# Altium schematic sheet 02-BlockDiagram.SchDoc: Block Diagram
size A3; DocumentNumber: 2; SheetNumber: 2; SheetTotal: 5
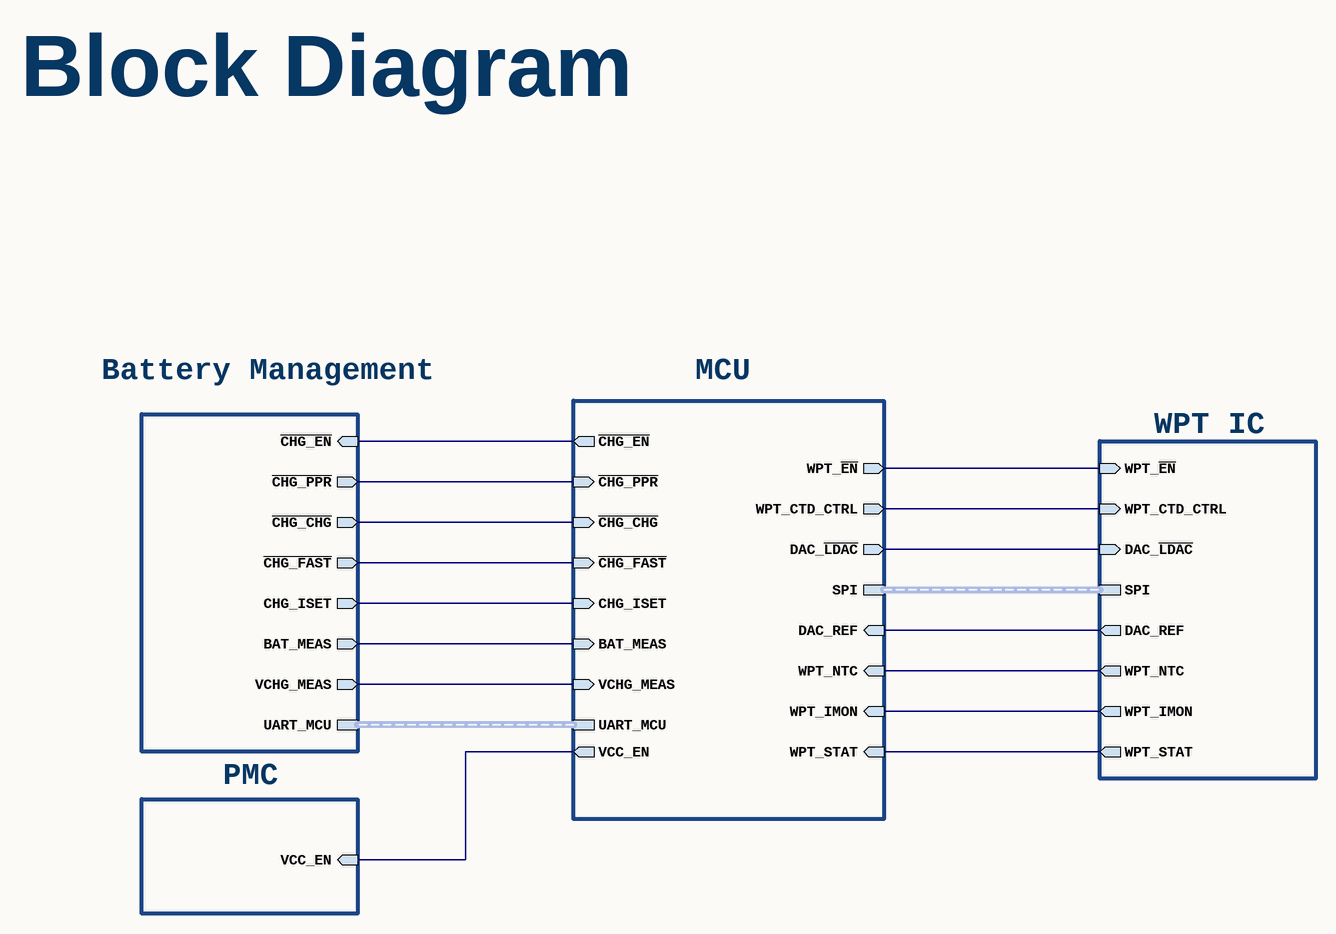
[diagram p0: 02-BlockDiagram.SchDoc]

## Sub-sheets
Battery Management = 06-BatteryManagement.SchDoc: ~{CHG_EN} (in), ~{CHG_PPR} (out), ~{CHG_CHG} (out), ~{CHG_FAST} (out), CHG_ISET (out), UART_MCU (harness UART_MCU), BAT_MEAS (out), VCHG_MEAS (out)
MCU = 03-MCU.SchDoc: ~{CHG_EN} (out), ~{CHG_PPR} (in), ~{CHG_CHG} (in), ~{CHG_FAST} (in), CHG_ISET (in), UART_MCU (harness UART_MCU), WPT_NTC (in), DAC_REF (in), DAC_~{LDAC} (out), WPT_CTD_CTRL (out), WPT_~{EN} (out), SPI (harness SPI), VCC_EN (out), WPT_IMON (in), WPT_STAT (in), BAT_MEAS (in), VCHG_MEAS (in)
PMC = 05-PMC.SchDoc: VCC_EN (in)
WPT IC = 04-WPT-IC.SchDoc: WPT_NTC (out), DAC_REF (out), DAC_~{LDAC} (in), WPT_CTD_CTRL (in), WPT_~{EN} (in), SPI (harness SPI), WPT_IMON (out), WPT_STAT (out)

## Nets
(unnamed): sheet MCU/~{CHG_EN}, sheet Battery Management/~{CHG_EN}
(unnamed): sheet MCU/~{CHG_PPR}, sheet Battery Management/~{CHG_PPR}
(unnamed): sheet MCU/~{CHG_CHG}, sheet Battery Management/~{CHG_CHG}
(unnamed): sheet MCU/~{CHG_FAST}, sheet Battery Management/~{CHG_FAST}
(unnamed): sheet MCU/CHG_ISET, sheet Battery Management/CHG_ISET
(unnamed): sheet MCU/WPT_NTC, sheet WPT IC/WPT_NTC
(unnamed): sheet MCU/DAC_REF, sheet WPT IC/DAC_REF
(unnamed): sheet MCU/DAC_~{LDAC}, sheet WPT IC/DAC_~{LDAC}
(unnamed): sheet MCU/WPT_CTD_CTRL, sheet WPT IC/WPT_CTD_CTRL
(unnamed): sheet MCU/WPT_~{EN}, sheet WPT IC/WPT_~{EN}
(unnamed): sheet MCU/VCC_EN, sheet PMC/VCC_EN
(unnamed): sheet MCU/WPT_IMON, sheet WPT IC/WPT_IMON
(unnamed): sheet MCU/WPT_STAT, sheet WPT IC/WPT_STAT
(unnamed): sheet MCU/BAT_MEAS, sheet Battery Management/BAT_MEAS
(unnamed): sheet MCU/VCHG_MEAS, sheet Battery Management/VCHG_MEAS

## Buses and harness runs
harness sheet Battery Management/UART_MCU = sheet MCU/UART_MCU
harness sheet MCU/SPI = sheet WPT IC/SPI

## Notes on the sheet
- Block Diagram
- Project:
- Schematic:
- Ver:
- .
- Design by:
- Reviewed by:
- Date:
- Comments: